# Altium schematic sheet ElectronicSpeedController.SchDoc: Electronic Speed Controller
size A4; DrawnBy: M. Small & J. Wilson; SheetNumber: 7; SheetTotal: 10
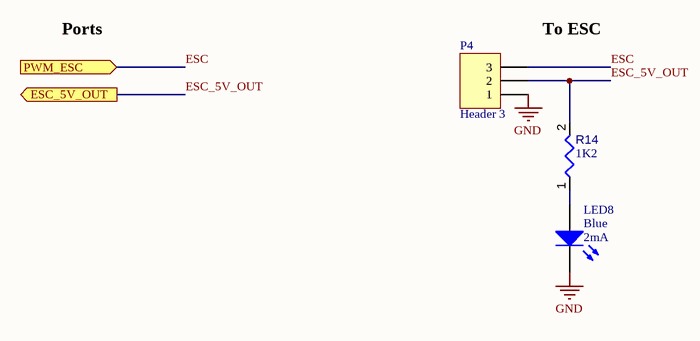
[diagram p0: ElectronicSpeedController.SchDoc]

## Parts
LED8  Blue  IF: 2mA  [1206_A]
P4  Header 3  [HDR1X3]
R14  1K2  [RESC0805(2012)_L]

## Ports
ESC_5V_OUT (out), PWM_ESC (in)

## Nets
GND: LED8.1(K) P4.1
ESC: P4.3 ; port PWM_ESC
ESC_5V_OUT: P4.2 R14.2 ; port ESC_5V_OUT
NetLED8_2: LED8.2(A) R14.1

## Notes on the sheet
- Ports
- (near P4) To ESC
- Date:
- Sheet
- of
- Time:
- Revision:
- Drawn by:
- File:

## Library data of the parts
LED8 = CMP-1426-00015-1: KPT-3216LVVBC-D -  LED, 3.2mm x 1.6mm, Blue, SMD, 2 mA, 2.65 V, 470 nm; Manufacturer: Kingbright; ComponentLink2Description: Datasheet; PartNumber: KPT-3216LVVBC-D; ComponentLink1Description: Manufacturer URL; ComponentLink2URL: http://www.farnell.com/datasheets/2068439.pdf; PackageReference: 1206_A; Color: Blue; Element14 Order Code: 2610425
P4 = Header 3: Header, 3-Pin; LatestRevisionDate: 17-Jul-2002; LatestRevisionNote: Re-released for DXP Platform.; Publisher: Altium Limited
R14 = CMP-009-00076-1: 1K2 0.125W 5% 0805 (2012 Metric)  SMD; Mounting Technology: SMT; Power: 0.125W; Value: 1K2; Pins: 2; Case/Package: 0805; Tolerance: 5%